# EAGLE design breakout (EAGLE 4.16)
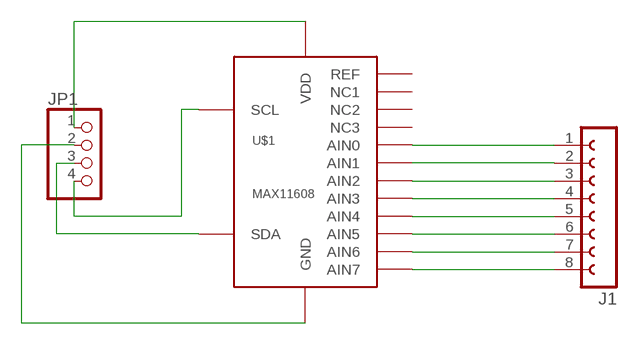
[diagram p0: schematic, sheet 1]

## Parts
J1  FE08-1100_MIL_PITCH  [FE08]
JP1  PINHD-1X4  [1X04]
U$1  MAX11608  [QSOP_16]

## Nets
AIN0: J1.1 U$1.P$5(AIN0)
AIN1: J1.2 U$1.P$6(AIN1)
AIN2: J1.3 U$1.P$7(AIN2)
AIN3: J1.4 U$1.P$8(AIN3)
AIN4: J1.5 U$1.P$9(AIN4)
AIN5: J1.6 U$1.P$10(AIN5)
AIN6: J1.7 U$1.P$11(AIN6)
AIN7: J1.8 U$1.P$12(AIN7)
GND: JP1.2 U$1.P$15(GND)
SCL: JP1.4 U$1.P$13(SCL)
SDA: JP1.3 U$1.P$14(SDA)
VCC: JP1.1 U$1.P$16(VDD)
Unconnected: U$1.P$1(REF) U$1.P$2(NC1) U$1.P$3(NC2) U$1.P$4(NC3)

## Library data of the parts
J1 = ATMEL:FE08-1: FEMALE HEADER
JP1 = Headers:PINHD-1X4: PIN HEADER
U$1 = Stofer:MAX11608

## Board
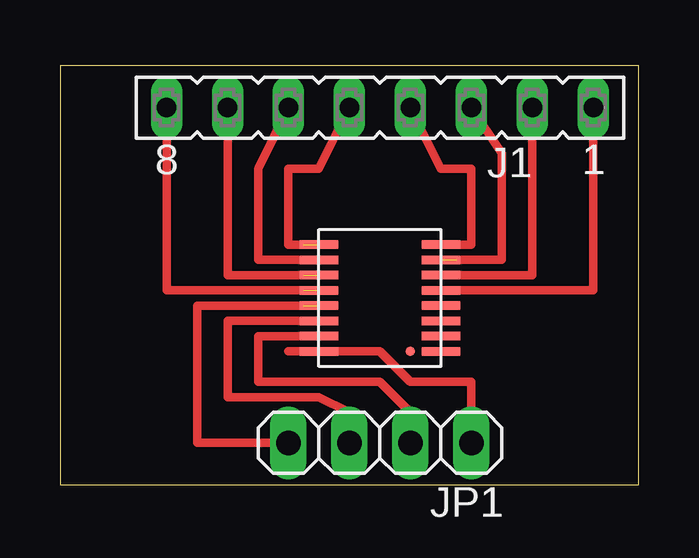
[diagram p1: board, top side]

Size 24.11 x 17.45 mm. Coordinates in mm from the lower left corner, seen from the top.
Outline: 0,0 24.11,0 24.11,17.45 0,17.45 0,0
Copper layers (1*2+15*16): Top 0.035mm / dielectric 0.2mm / Route2 0.035mm / dielectric 0.15mm / Route15 0.035mm / dielectric 0.2mm / Bottom 0.035mm
Design rules "default": minimum track width 10mil, minimum drill 24mil, track to track 8mil, track to pad 8mil, pad to pad 8mil, via to via 8mil, smd to smd 8mil, copper to edge 40mil, drill to drill 8mil, minimum pad ring 10mil, minimum via ring 8mil, stop-mask expansion 4mil, vias tented up to drill 0mil, thermal gap 10mil

### Footprints (pad centres in the part's own frame; a part is rotated, then mirrored left to right if it is on the bottom)
FE08 = drill 0.813 long: 1 -8.89,0; 2 -6.35,0; 3 -3.81,0; 4 -1.27,0; 5 1.27,0; 6 3.81,0; 7 6.35,0; 8 8.89,0
1X04 = drill 1.016 long: 1 -3.81,0; 2 -1.27,0; 3 1.27,0; 4 3.81,0
QSOP_16 = smd 1.6 x 0.356: P$1 3.81,-2.54; P$2 3.81,-1.905; P$3 3.81,-1.27; P$4 3.81,-0.635; P$5 3.81,0; P$6 3.81,0.635; P$7 3.81,1.27; P$8 3.81,1.905; P$9 -1.27,1.905; P$10 -1.27,1.27; P$11 -1.27,0.635; P$12 -1.27,0; P$13 -1.27,-0.635; P$14 -1.27,-1.27; P$15 -1.27,-1.905; P$16 -1.27,-2.54 | smd 0.406 x 0.406: P$18 2.54,-2.54

### Placement (x,y rotation side)
J1  13.33,15.71 180 top
JP1  13.33,1.74 180 top
U$1  12.06,8.09 0 top

### Tracks (layer width: path | path; a pad name or v marks a point on that pad's centre or on a via)
AIN0
  Top 0.356: U$1.P$5 22.22,8.09 J1.1
AIN1
  Top 0.356: U$1.P$6 19.68,8.73 J1.2
AIN2  (1 unrouted)
  Top 0.356: 16.5,9.36 18.41,9.36 18.41,13.81 J1.3
AIN3
  Top 0.356: J1.4 15.87,13.17 17.14,13.17 17.14,10 U$1.P$8
AIN4  (1 unrouted)
  Top 0.356: 10.16,10 9.52,10 9.52,13.17 10.79,13.17 J1.5
AIN5
  Top 0.356: U$1.P$10 8.25,9.36 8.25,13.17 J1.6
AIN6  (1 unrouted)
  Top 0.356: 10.16,8.73 6.98,8.73 J1.7
AIN7  (1 unrouted)
  Top 0.356: 10.16,8.09 4.44,8.09 J1.8
GND
  Top 0.356: U$1.P$15 8.25,6.18 8.25,4.28 13.33,4.28 14.6,3.01 JP1.2
SCL  (1 unrouted)
  Top 0.356: 10.16,7.46 5.71,7.46 5.71,1.74 JP1.4
SDA
  Top 0.356: JP1.3 12.06,3.01 10.79,3.64 6.98,3.64 6.98,6.82 9.52,6.82 U$1.P$14
VCC
  Top 0.356: 9.52,5.55 U$1.P$16 13.33,5.55 14.6,4.28 17.14,4.28 JP1.1